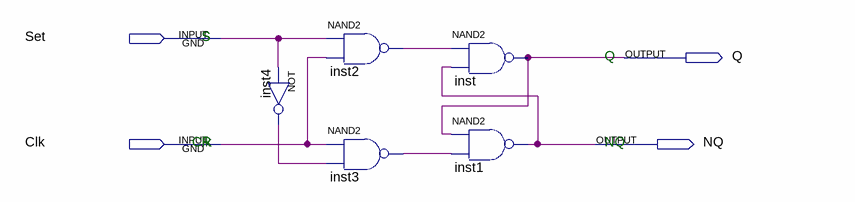
[diagram p0: schematic sheet]
// Quartus schematic D_FlipFlop.bdf as structural Verilog: 5 symbols, 4 pins
module D_FlipFlop (
  input  Set,
  input  Clk,
  output Q,
  output NQ
);

  wire inst2_out, inst3_out, inst4_out;

  not inst4 (inst4_out, Set);
  nand inst2 (inst2_out, Set, Clk);
  nand inst3 (inst3_out, Clk, inst4_out);
  nand inst (Q, inst2_out, NQ);
  nand inst1 (NQ, Q, inst3_out);

  // Notes on the sheet:
  //   S
  //   S
  //   Q
  //   Clk
  //   R
  //   NQ
endmodule
